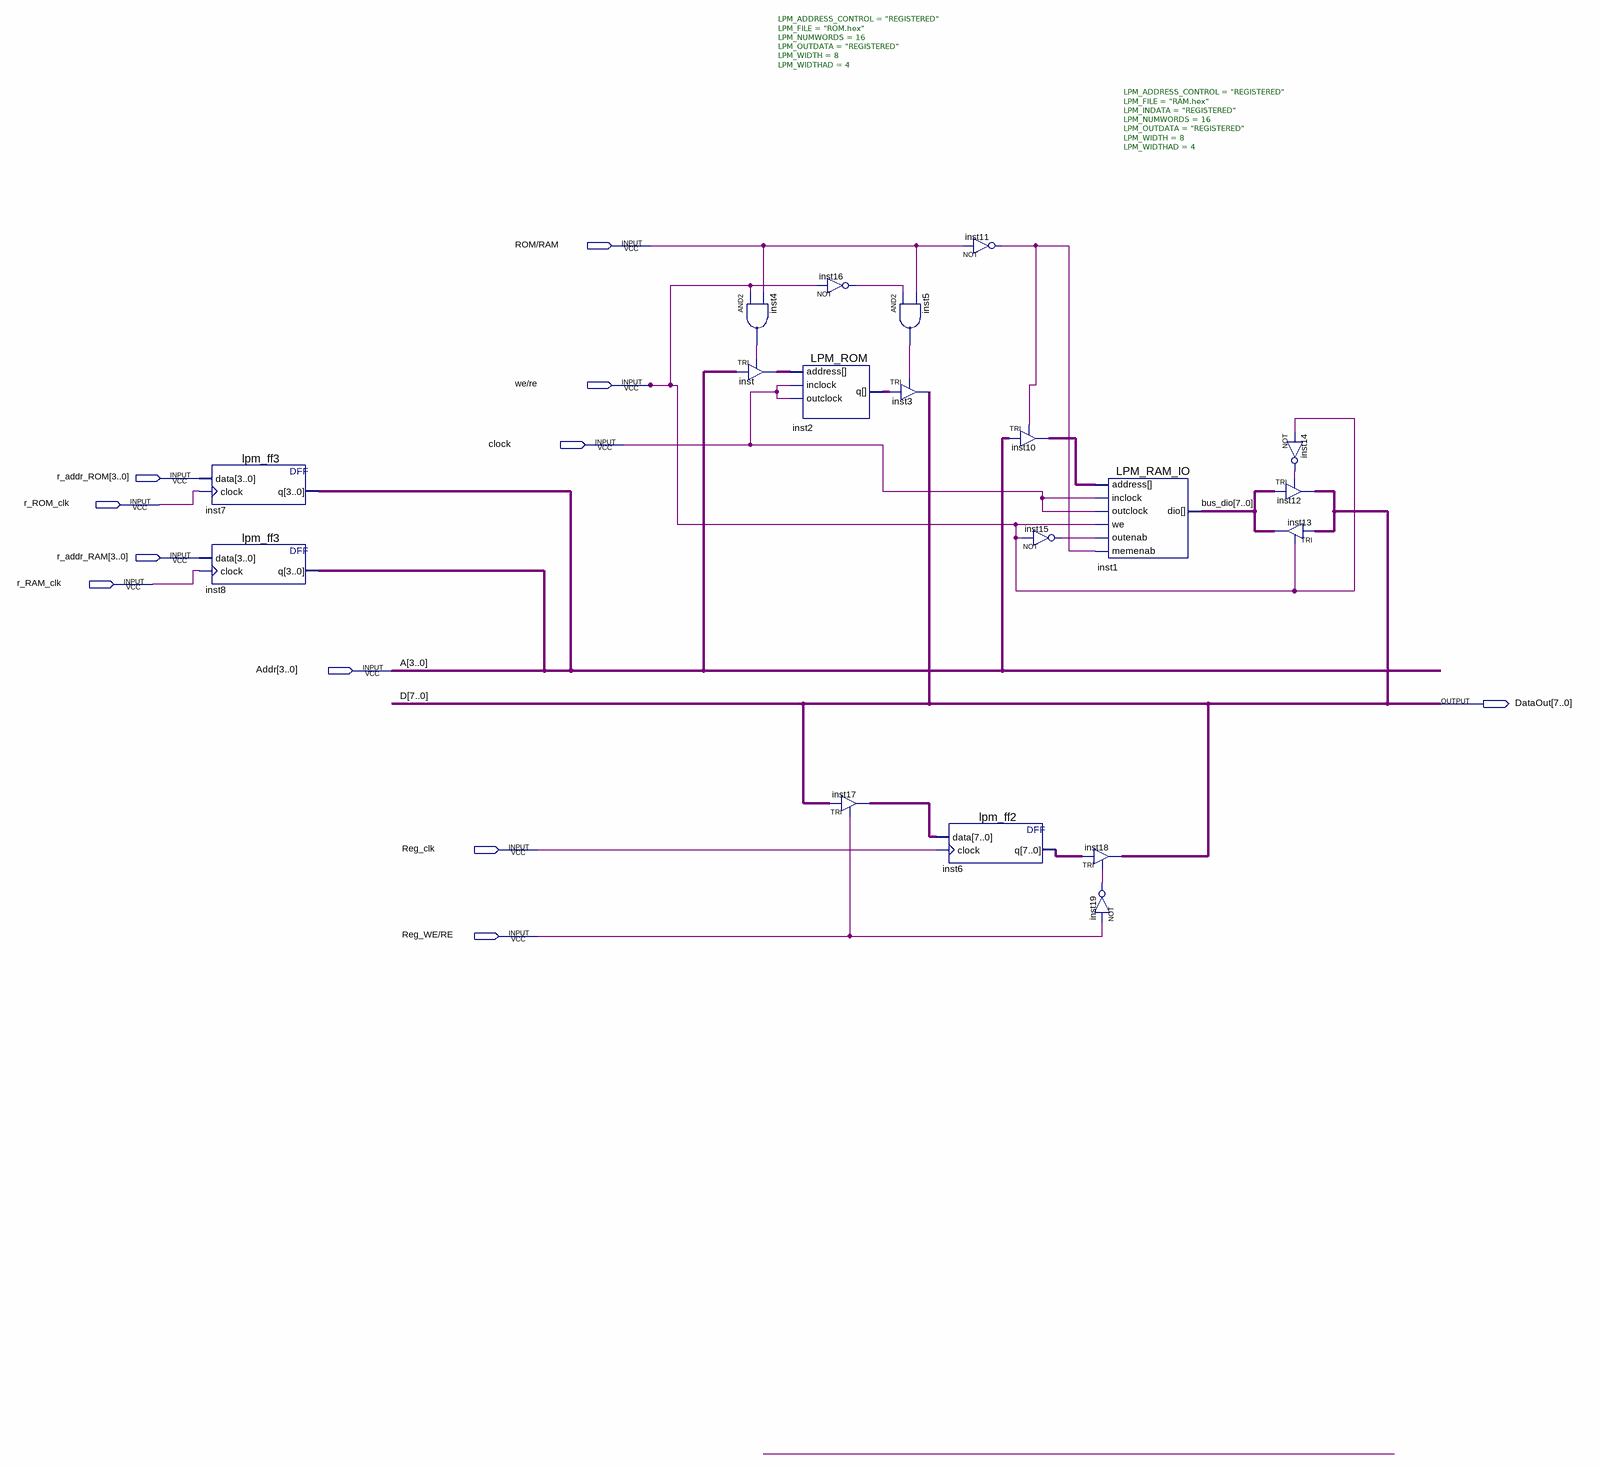
[diagram p0: schematic sheet]
// Quartus schematic Lab_3 (yurket if's conflicted copy 2012-04-24).bdf as structural Verilog: 19 symbols, 11 pins
module \Lab_3_(yurket_if's_conflicted_copy_2012-04-24)  (
  input  \ROM/RAM ,
  input  \we/re ,
  input  clock,
  input  [3:0] r_addr_ROM,
  input  r_ROM_clk,
  input  [3:0] r_addr_RAM,
  input  r_RAM_clk,
  input  [3:0] Addr,
  input  Reg_clk,
  input  \Reg_WE/RE ,
  output [7:0] DataOut
);

  wire inst4_out, inst5_out, inst11_out, inst14_out, inst15_out, inst16_out, inst19_out;
  wire [3:0] inst10_out, inst_out;
  wire [7:0] bus_dio, inst2_q, inst6_q, inst17_out;

  lpm_ff3 inst7 (.data(r_addr_ROM), .clock(r_ROM_clk), .q(Addr));
  lpm_ff3 inst8 (.data(r_addr_RAM), .clock(r_RAM_clk), .q(Addr));
  and inst4 (inst4_out, \we/re , \ROM/RAM );
  TRI inst[3:0] (.IN(Addr), .OE(inst4_out), .OUT(inst_out));
  not inst16 (inst16_out, \we/re );
  LPM_ROM #(.LPM_ADDRESS_CONTROL("REGISTERED"), .LPM_FILE("ROM.hex"), .LPM_NUMWORDS(16), .LPM_OUTDATA("REGISTERED"), .LPM_WIDTH(8), .LPM_WIDTHAD(4)) inst2 (
    .address(inst_out), .inclock(clock), .outclock(clock), .q(inst2_q));
  TRI inst17[7:0] (.IN(DataOut), .OE(\Reg_WE/RE ), .OUT(inst17_out));
  and inst5 (inst5_out, inst16_out, \ROM/RAM );
  TRI inst3[7:0] (.IN(inst2_q), .OE(inst5_out), .OUT(DataOut));
  not inst11 (inst11_out, \ROM/RAM );
  lpm_ff2 inst6 (.data(inst17_out), .clock(Reg_clk), .q(inst6_q));
  TRI inst10[3:0] (.IN(Addr), .OE(inst11_out), .OUT(inst10_out));
  not inst15 (inst15_out, \we/re );
  TRI inst18[7:0] (.IN(inst6_q), .OE(inst19_out), .OUT(DataOut));
  LPM_RAM_IO #(.LPM_ADDRESS_CONTROL("REGISTERED"), .LPM_FILE("RAM.hex"), .LPM_INDATA("REGISTERED"), .LPM_NUMWORDS(16), .LPM_OUTDATA("REGISTERED"), .LPM_WIDTH(8), .LPM_WIDTHAD(4)) inst1 (
    .address(inst10_out), .outclock(clock), .memenab(inst11_out), .inclock(clock), .we(\we/re ),
    .outenab(inst15_out), .dio(bus_dio));
  not inst19 (inst19_out, \Reg_WE/RE );
  not inst14 (inst14_out, \we/re );
  TRI inst12[7:0] (.IN(bus_dio), .OE(inst14_out), .OUT(DataOut));
  TRI inst13[7:0] (.IN(DataOut), .OE(\we/re ), .OUT(bus_dio));

  // Other names for the same wires on the sheet: A[3:0] = Addr; D[7:0] = DataOut
endmodule
